# EAGLE design zx81-keyboard (EAGLE 7.6.0)
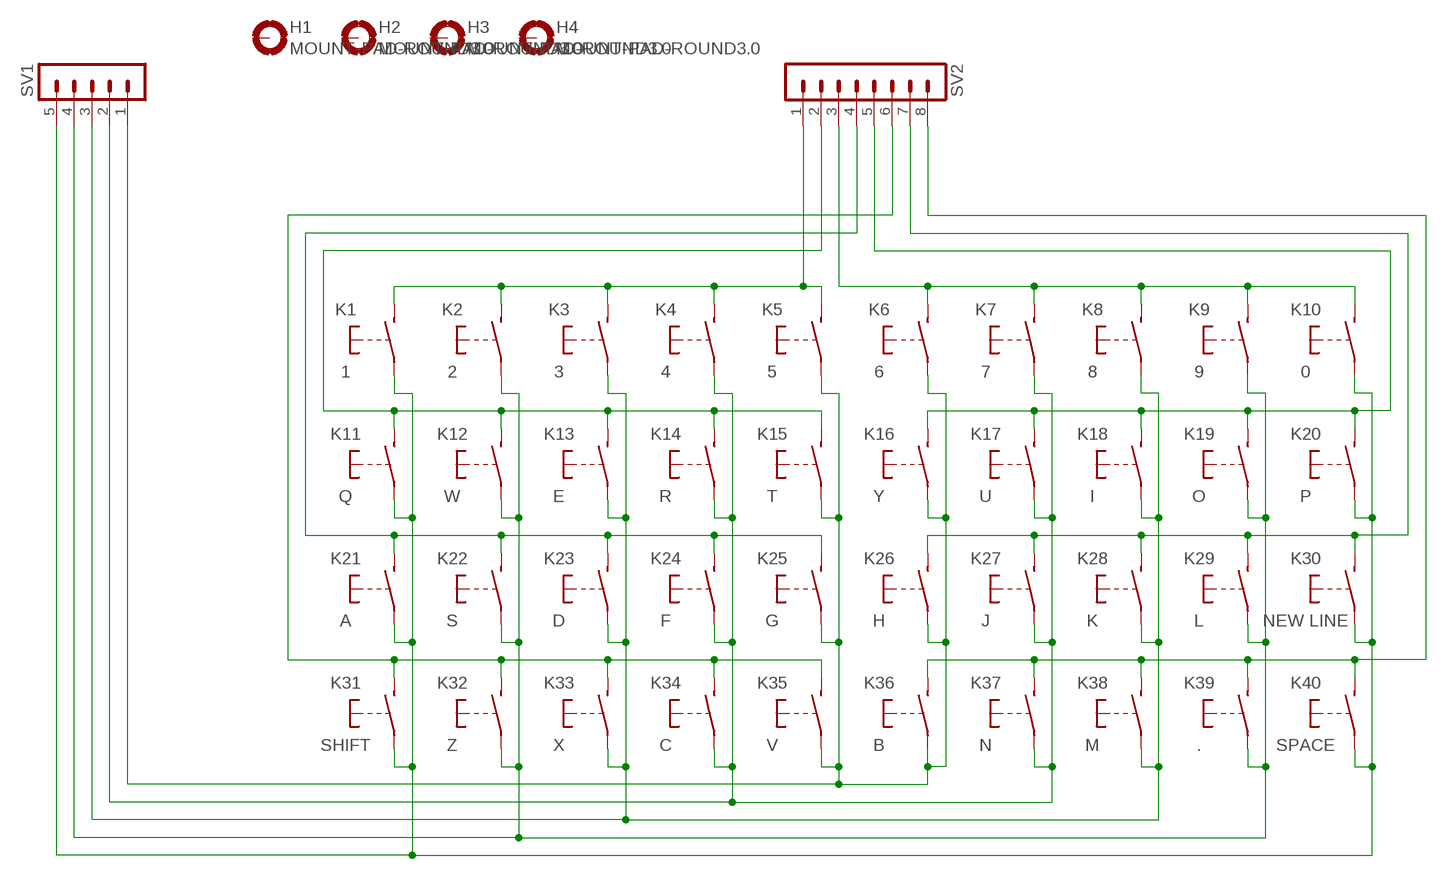
[diagram p0: schematic, sheet 1]

## Parts
H1  MOUNT-PAD-ROUND3.0  [3,0-PAD]
H2  MOUNT-PAD-ROUND3.0  [3,0-PAD]
H3  MOUNT-PAD-ROUND3.0  [3,0-PAD]
H4  MOUNT-PAD-ROUND3.0  [3,0-PAD]
K1  1  MARQUART-6425  [MARQUARTDT-6425]
K2  2  MARQUART-6425  [MARQUARTDT-6425]
K3  3  MARQUART-6425  [MARQUARTDT-6425]
K4  4  MARQUART-6425  [MARQUARTDT-6425]
K5  5  MARQUART-6425  [MARQUARTDT-6425]
K6  6  MARQUART-6425  [MARQUARTDT-6425]
K7  7  MARQUART-6425  [MARQUARTDT-6425]
K8  8  MARQUART-6425  [MARQUARTDT-6425]
K9  9  MARQUART-6425  [MARQUARTDT-6425]
K10  0  MARQUART-6425  [MARQUARTDT-6425]
K11  Q  MARQUART-6425  [MARQUARTDT-6425]
K12  W  MARQUART-6425  [MARQUARTDT-6425]
K13  E  MARQUART-6425  [MARQUARTDT-6425]
K14  R  MARQUART-6425  [MARQUARTDT-6425]
K15  T  MARQUART-6425  [MARQUARTDT-6425]
K16  Y  MARQUART-6425  [MARQUARTDT-6425]
K17  U  MARQUART-6425  [MARQUARTDT-6425]
K18  I  MARQUART-6425  [MARQUARTDT-6425]
K19  O  MARQUART-6425  [MARQUARTDT-6425]
K20  P  MARQUART-6425  [MARQUARTDT-6425]
K21  A  MARQUART-6425  [MARQUARTDT-6425]
K22  S  MARQUART-6425  [MARQUARTDT-6425]
K23  D  MARQUART-6425  [MARQUARTDT-6425]
K24  F  MARQUART-6425  [MARQUARTDT-6425]
K25  G  MARQUART-6425  [MARQUARTDT-6425]
K26  H  MARQUART-6425  [MARQUARTDT-6425]
K27  J  MARQUART-6425  [MARQUARTDT-6425]
K28  K  MARQUART-6425  [MARQUARTDT-6425]
K29  L  MARQUART-6425  [MARQUARTDT-6425]
K30  NEW LINE  MARQUART-6425  [MARQUARTDT-6425]
K31  SHIFT  MARQUART-6425  [MARQUARTDT-6425]
K32  Z  MARQUART-6425  [MARQUARTDT-6425]
K33  X  MARQUART-6425  [MARQUARTDT-6425]
K34  C  MARQUART-6425  [MARQUARTDT-6425]
K35  V  MARQUART-6425  [MARQUARTDT-6425]
K36  B  MARQUART-6425  [MARQUARTDT-6425]
K37  N  MARQUART-6425  [MARQUARTDT-6425]
K38  M  MARQUART-6425  [MARQUARTDT-6425]
K39  .  MARQUART-6425  [MARQUARTDT-6425]
K40  SPACE  MARQUART-6425  [MARQUARTDT-6425]
SV1  MA05-1  [MA05-1]
SV2  MA08-1  [MA08-1]

## Nets
N$1: K1.P$2(S) K2.P$2(S) K3.P$2(S) K4.P$2(S) K5.P$2(S) SV2.1
N$2: K6.P$2(S) K7.P$2(S) K8.P$2(S) K9.P$2(S) K10.P$2(S) SV2.3
N$3: K11.P$2(S) K12.P$2(S) K13.P$2(S) K14.P$2(S) K15.P$2(S) SV2.2
N$4: K21.P$2(S) K22.P$2(S) K23.P$2(S) K24.P$2(S) K25.P$2(S) SV2.4
N$5: K31.P$2(S) K32.P$2(S) K33.P$2(S) K34.P$2(S) K35.P$2(S) SV2.6
N$6: K16.P$2(S) K17.P$2(S) K18.P$2(S) K19.P$2(S) K20.P$2(S) SV2.5
N$7: K26.P$2(S) K27.P$2(S) K28.P$2(S) K29.P$2(S) K30.P$2(S) SV2.7
N$8: K36.P$2(S) K37.P$2(S) K38.P$2(S) K39.P$2(S) K40.P$2(S) SV2.8
N$9: K5.P$1(P) K6.P$1(P) K15.P$1(P) K16.P$1(P) K25.P$1(P) K26.P$1(P) K35.P$1(P) K36.P$1(P) SV1.1
N$15: K4.P$1(P) K7.P$1(P) K14.P$1(P) K17.P$1(P) K24.P$1(P) K27.P$1(P) K34.P$1(P) K37.P$1(P) SV1.2
N$22: K3.P$1(P) K8.P$1(P) K13.P$1(P) K18.P$1(P) K23.P$1(P) K28.P$1(P) K33.P$1(P) K38.P$1(P) SV1.3
N$29: K2.P$1(P) K9.P$1(P) K12.P$1(P) K19.P$1(P) K22.P$1(P) K29.P$1(P) K32.P$1(P) K39.P$1(P) SV1.4
N$36: K1.P$1(P) K10.P$1(P) K11.P$1(P) K20.P$1(P) K21.P$1(P) K30.P$1(P) K31.P$1(P) K40.P$1(P) SV1.5
Unconnected: H1.B3,0(MOUNT) H2.B3,0(MOUNT) H3.B3,0(MOUNT) H4.B3,0(MOUNT)

## Library data of the parts
H1-H4 = holes:MOUNT-PAD-ROUND: MOUNTING PAD, round
K1-K40 = Thorsten_Pushbuttons:MARQUART-6425
SV1 = con-lstb:MA05-1: PIN HEADER; OC_FARNELL: unknown; OC_NEWARK: unknown
SV2 = con-lstb:MA08-1: PIN HEADER; OC_FARNELL: unknown; OC_NEWARK: unknown

## Board
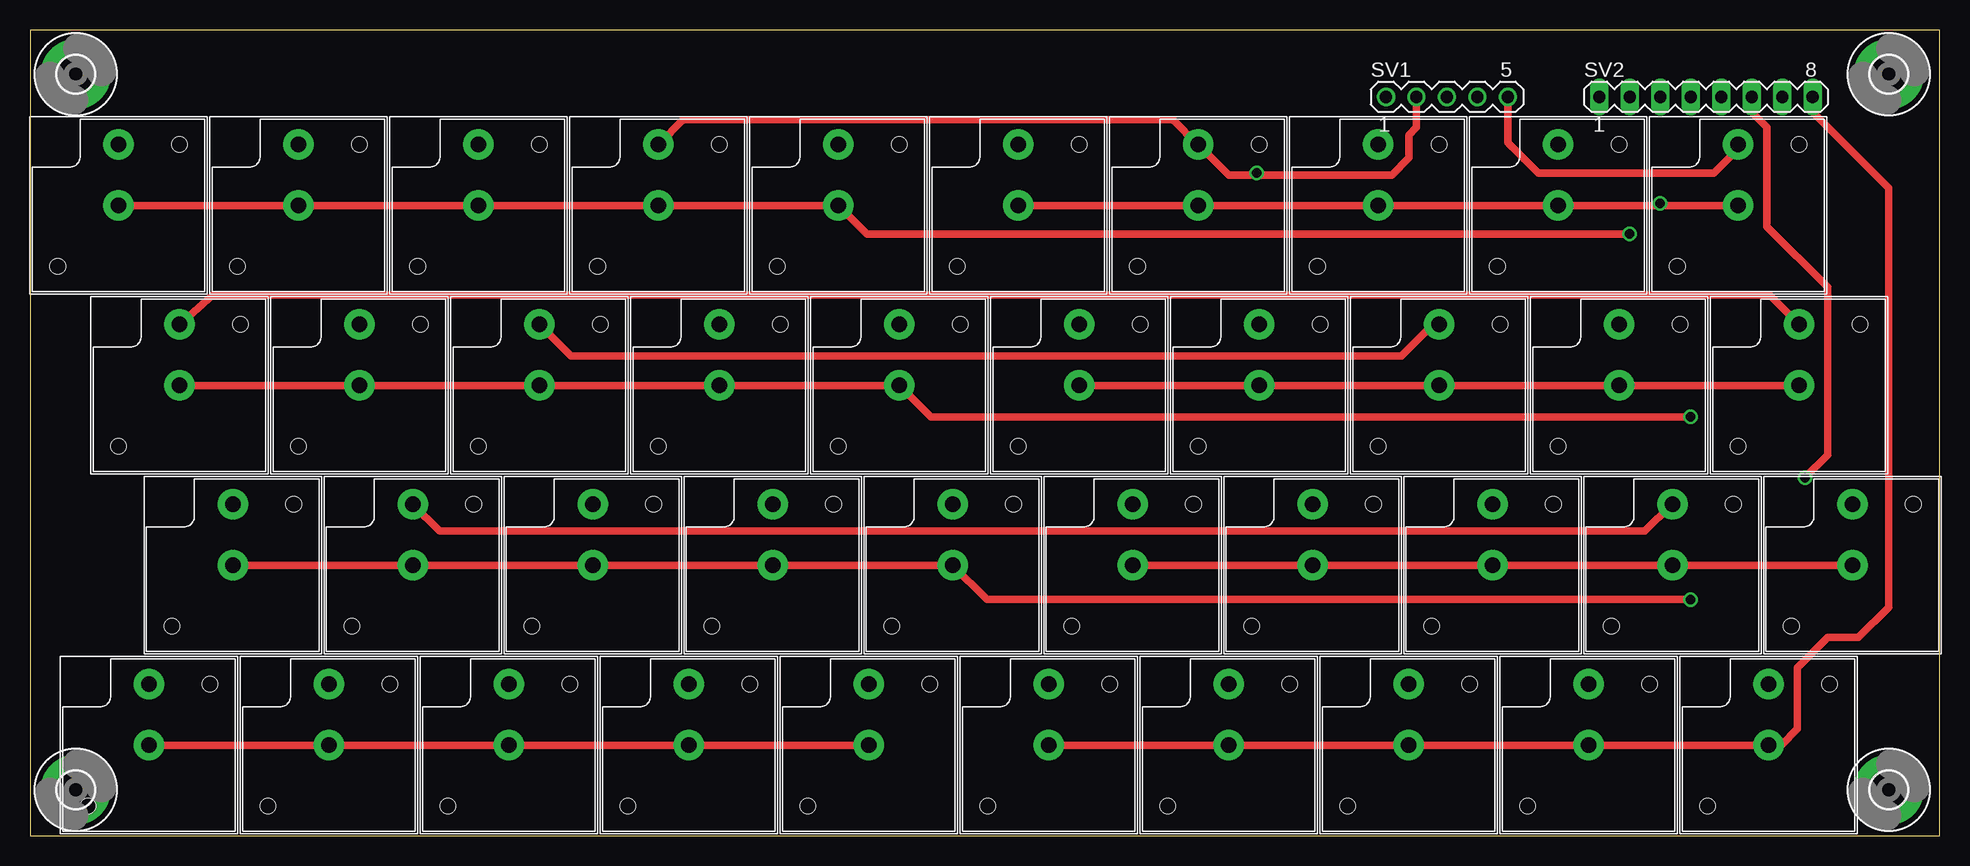
[diagram p1: board, top side]
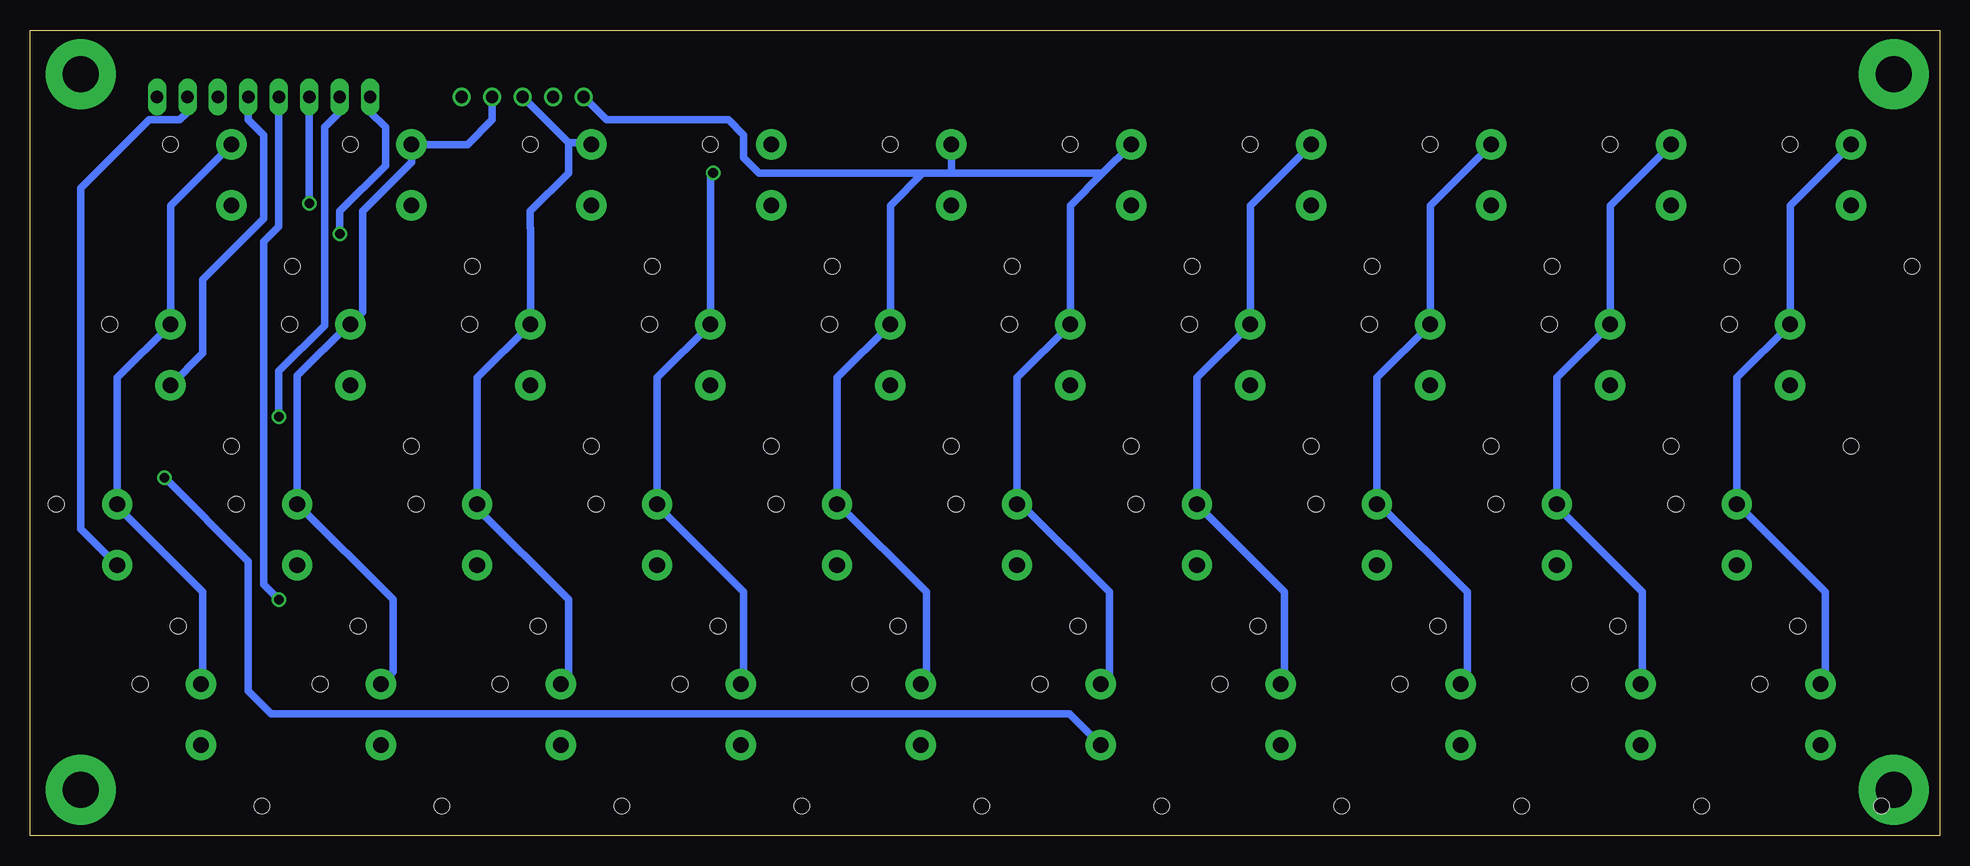
[diagram p2: board, bottom side, seen from below]

Size 159.18 x 67.17 mm. Coordinates in mm from the lower left corner, seen from the top.
Outline: 0,0 159.18,0 159.18,67.17 0,67.17 0,0
Copper layers (1*16): Top 0.035mm / dielectric 1.5mm / Bottom 0.035mm
Design rules "default *": minimum track width 10mil, minimum drill 24mil, track to track 8mil, track to pad 8mil, pad to pad 8mil, via to via 8mil, smd to smd 8mil, copper to edge 40mil, drill to drill 8mil, minimum pad ring 10mil, minimum via ring 8mil, stop-mask expansion 4mil, vias tented up to drill 0mil, thermal gap 10mil

### Footprints (pad centres in the part's own frame; a part is rotated, then mirrored left to right if it is on the bottom)
3,0-PAD = drill 3 pad 5.842: B3,0 0,0
MARQUARTDT-6425 = drill 1.3 pad 2.54: P$1 0,5.08; P$2 0,0 | hole 1.3: 5.08,5.08; -5.08,-5.08
MA05-1 = drill 1.016: 1 -5.08,0; 2 -2.54,0; 3 0,0; 4 2.54,0; 5 5.08,0
MA08-1 = drill 1.016 long: 1 -8.89,0; 2 -6.35,0; 3 -3.81,0; 4 -1.27,0; 5 1.27,0; 6 3.81,0; 7 6.35,0; 8 8.89,0

### Placement (x,y rotation side)
H1  154.94,63.5 0 top
H2  154.94,3.81 0 top
H3  3.81,3.81 0 top
H4  3.81,63.5 0 top
K1  7.38,52.55 0 top
K2  22.38,52.55 0 top
K3  37.38,52.55 0 top
K4  52.38,52.55 0 top
K5  67.38,52.55 0 top
K6  82.38,52.55 0 top
K7  97.38,52.55 0 top
K8  112.38,52.55 0 top
K9  127.38,52.55 0 top
K10  142.38,52.55 0 top
K11  12.46,37.55 0 top
K12  27.46,37.55 0 top
K13  42.46,37.55 0 top
K14  57.46,37.55 0 top
K15  72.46,37.55 0 top
K16  87.46,37.55 0 top
K17  102.46,37.55 0 top
K18  117.46,37.55 0 top
K19  132.46,37.55 0 top
K20  147.46,37.55 0 top
K21  16.91,22.55 0 top
K22  31.91,22.55 0 top
K23  46.91,22.55 0 top
K24  61.91,22.55 0 top
K25  76.91,22.55 0 top
K26  91.91,22.55 0 top
K27  106.91,22.55 0 top
K28  121.91,22.55 0 top
K29  136.91,22.55 0 top
K30  151.91,22.55 0 top
K31  9.92,7.55 0 top
K32  24.92,7.55 0 top
K33  39.92,7.55 0 top
K34  54.92,7.55 0 top
K35  69.92,7.55 0 top
K36  84.92,7.55 0 top
K37  99.92,7.55 0 top
K38  114.92,7.55 0 top
K39  129.92,7.55 0 top
K40  144.92,7.55 0 top
SV1  118.11,61.59 0 top
SV2  139.7,61.59 0 top

### Tracks (layer width: path | path; a pad name or v marks a point on that pad's centre or on a via)
N$1  (via drill 0.8)
  Top 0.61: K1.P$2 K2.P$2 K3.P$2 K4.P$2 K5.P$2 69.77,50.16 v133.35,50.16
  Bottom 0.61: SV2.1 130.81,60.33 129.54,59.05 129.54,55.88 133.35,52.07 v133.35,50.16
N$2  (via drill 0.8)
  Top 0.61: K6.P$2 K7.P$2 K8.P$2 K9.P$2 135.89,52.55 | 135.89,52.55 K10.P$2 | v135.89,52.7 135.89,52.55
  Bottom 0.61: SV2.3 v135.89,52.7
N$3  (via drill 0.8)
  Top 0.61: K11.P$2 K12.P$2 K13.P$2 K14.P$2 K15.P$2 75.08,34.92 v138.43,34.92
  Bottom 0.61: SV2.2 133.35,60.33 134.62,59.05 134.62,42.55 138.43,38.73 v138.43,34.92
N$4  (via drill 0.8)
  Top 0.61: K21.P$2 K22.P$2 K23.P$2 K24.P$2 K25.P$2 79.77,19.68 v138.43,19.68
  Bottom 0.61: SV2.4 138.43,50.8 139.7,49.53 139.7,20.95 v138.43,19.68
N$5  (via drill 0.8)
  Top 0.61: K31.P$2 K32.P$2 K33.P$2 K34.P$2 K35.P$2 | SV2.6 143.51,60.33 144.78,59.05 144.78,50.8 149.86,45.72 149.86,31.75 v147.96,29.84
  Bottom 0.61: K35.P$2 72.53,10.16 139.06,10.16 140.97,12.06 140.97,22.86 v147.96,29.84
N$6
  Top 0.61: K16.P$2 K17.P$2 K18.P$2 K19.P$2 K20.P$2
  Bottom 0.61: SV2.5 140.97,59.69 139.7,58.42 139.7,51.44 144.78,46.35 144.78,40.23 K20.P$2
N$7
  Top 0.61: K26.P$2 K27.P$2 K28.P$2 K29.P$2 K30.P$2
  Bottom 0.61: SV2.7 146.05,60.33 146.69,59.69 149.22,59.69 154.94,53.98 154.94,25.59 K30.P$2
N$8
  Top 0.61: K36.P$2 K37.P$2 K38.P$2 K39.P$2 K40.P$2 145.98,7.55 147.32,8.89 147.32,13.97 149.86,16.51 152.4,16.51 154.94,19.05 154.94,53.98 148.59,60.33 SV2.8
N$9
  Bottom 0.61: K5.P$1 69.77,55.24 | 69.77,55.24 72.46,52.55 K15.P$1 76.91,38.19 K25.P$1 76.53,27.63 69.22,20.32 69.22,13.34 K35.P$1 | 84.77,55.24 87.46,52.55 K16.P$1 91.91,38.19 K26.P$1 91.77,27.63 84.45,20.32 84.45,13.1 K36.P$1 | SV1.1 111.12,59.69 100.97,59.69 99.69,58.42 99.69,56.52 98.42,55.24 84.77,55.24 | 84.77,55.24 82.55,55.24 | 82.55,55.24 69.77,55.24 | K6.P$1 82.38,55.41 82.55,55.24
N$15  (via drill 0.8)
  Top 0.61: K4.P$1 54.44,59.69 95.25,59.69 97.31,57.63 K7.P$1 99.92,55.09 102.23,55.09 | SV1.2 115.57,59.05 114.94,58.42 114.94,56.52 113.51,55.09 102.23,55.09 | v102.23,55.24 102.23,55.09
  Bottom 0.61: K4.P$1 57.46,52.55 K14.P$1 61.91,38.19 K24.P$1 61.91,27.61 54.61,20.32 54.61,12.94 K34.P$1 | K37.P$1 99.69,12.86 99.69,20.32 106.91,27.53 K27.P$1 106.91,38.19 K17.P$1 102.46,55.02 v102.23,55.24
N$22
  Top 0.61: K18.P$1 116.92,42.63 114.3,40.01 45.09,40.01 K13.P$1
  Bottom 0.61: K3.P$1 42.46,52.55 K13.P$1 46.91,38.19 K23.P$1 46.68,27.63 39.37,20.32 39.37,13.18 K33.P$1 | K38.P$1 114.3,13.25 114.3,19.68 121.91,27.29 K28.P$1 121.91,38.19 K18.P$1 117.46,50.65 117.47,50.66 117.47,52.07 114.3,55.24 114.3,57.78 | SV1.3 114.3,57.78 | 114.3,57.78 112.53,57.78 K8.P$1
N$29
  Top 0.61: K29.P$1 136.85,27.63 134.62,25.4 34.13,25.4 K22.P$1
  Bottom 0.61: K2.P$1 27.46,52.55 K12.P$1 31.91,38.19 K22.P$1 31.91,27.46 24.77,20.32 24.77,12.79 K32.P$1 | K39.P$1 128.91,13.64 128.91,19.68 136.85,27.63 K29.P$1 136.91,38.35 132.63,42.63 K19.P$1 131.44,43.65 131.44,52.07 127.38,56.13 K9.P$1 122.71,57.63 120.65,59.69 SV1.4
N$36
  Top 0.61: K10.P$1 142.38,57.29 140.34,55.24 125.73,55.24 123.19,57.78 SV1.5 | K11.P$1 15.24,45.09 145,45.09 K20.P$1
  Bottom 0.61: K1.P$1 12.46,52.55 K11.P$1 16.91,38.19 K21.P$1 16.84,27.63 9.53,20.32 9.53,13.03 K31.P$1 | K10.P$1 147.46,52.55 K20.P$1 151.91,38.19 K30.P$1 151.91,27.45 144.78,20.32 144.78,12.77 K40.P$1